# Altium project BMS_MAINBOARD_6.PrjPCB
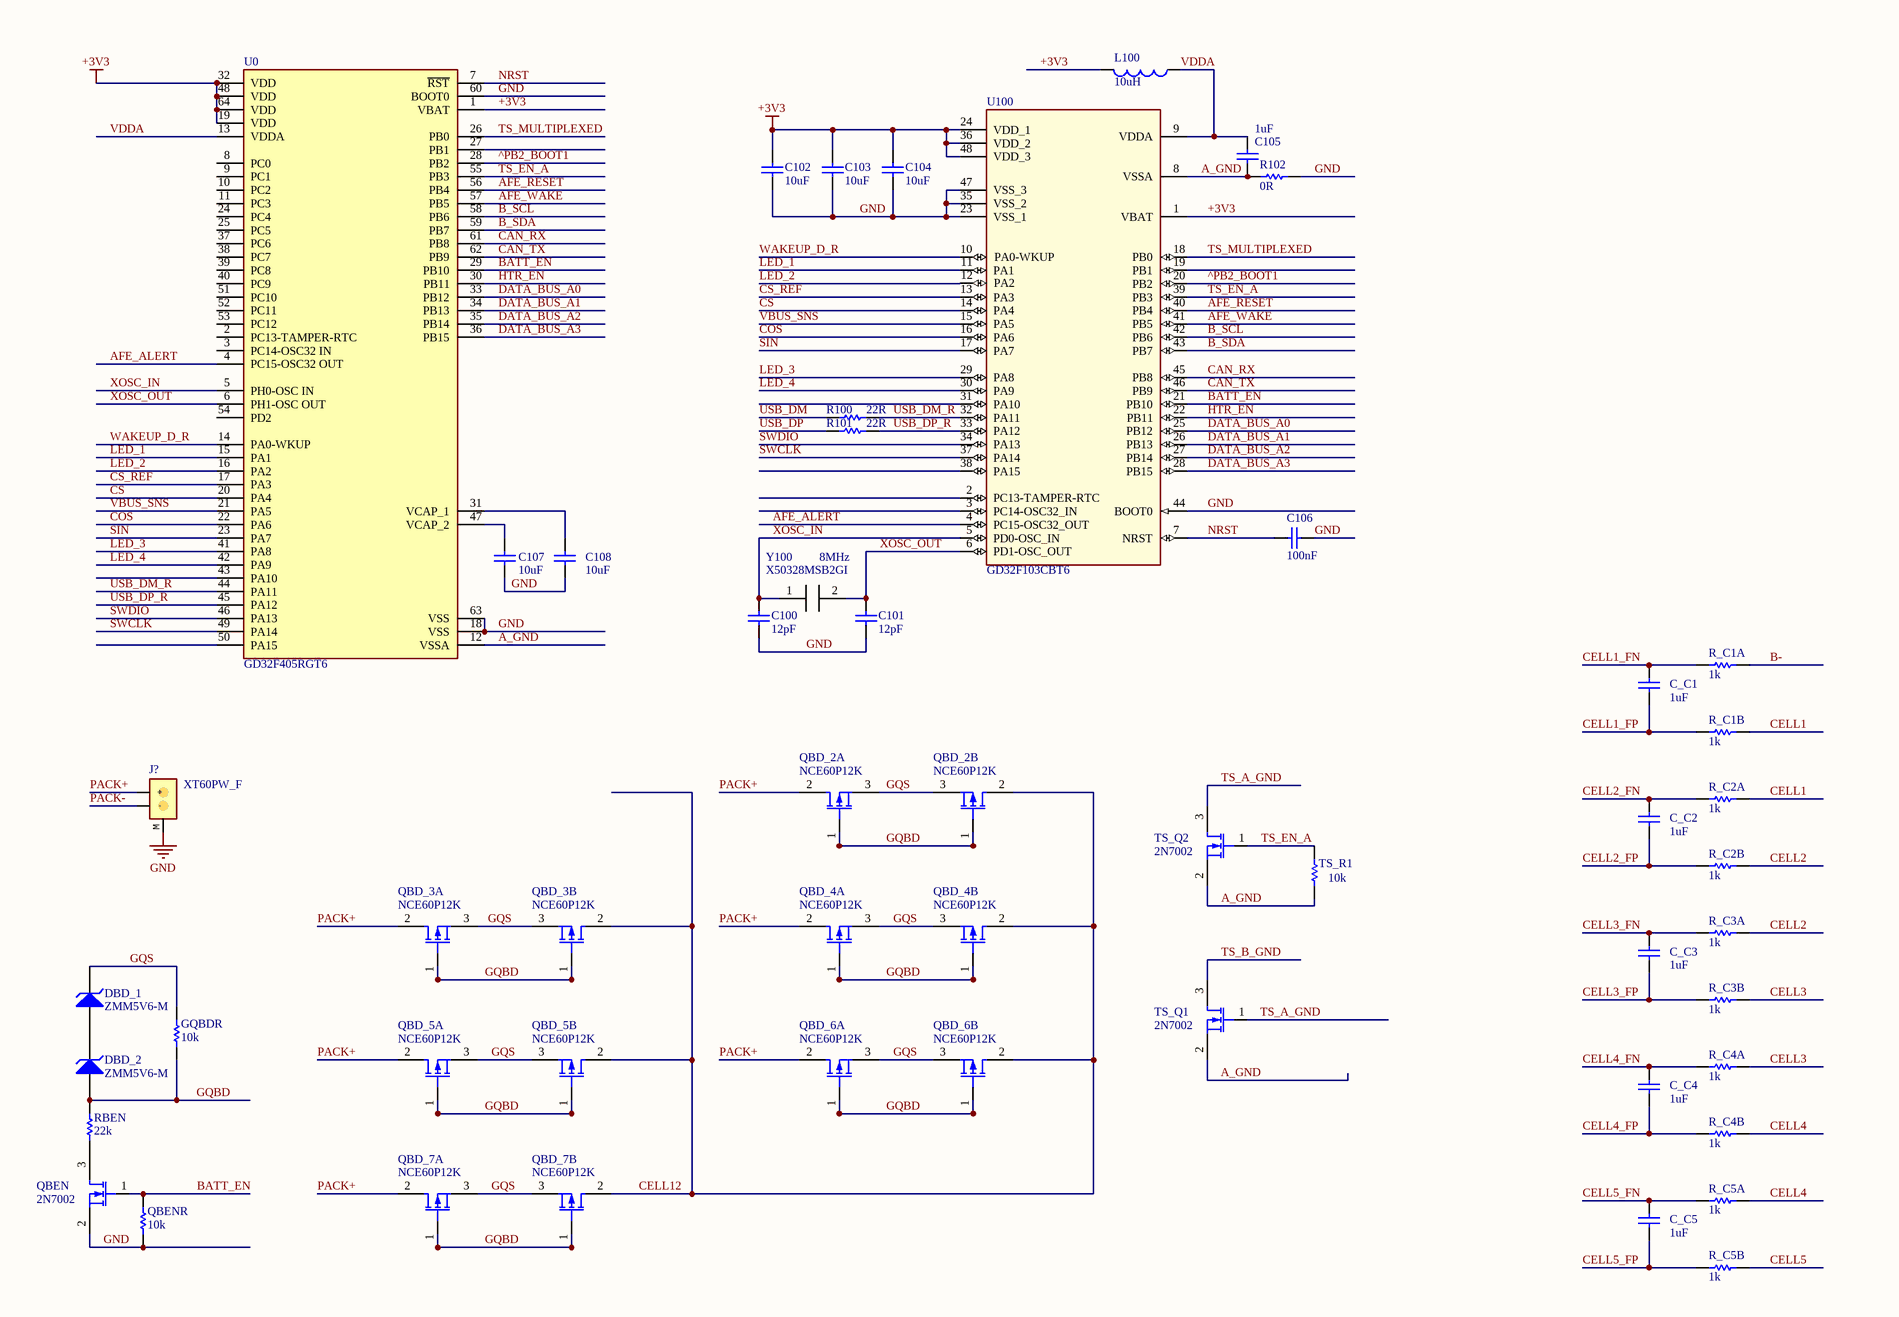
[diagram p0: BMS_MAINBOARD.SchDoc, top left]
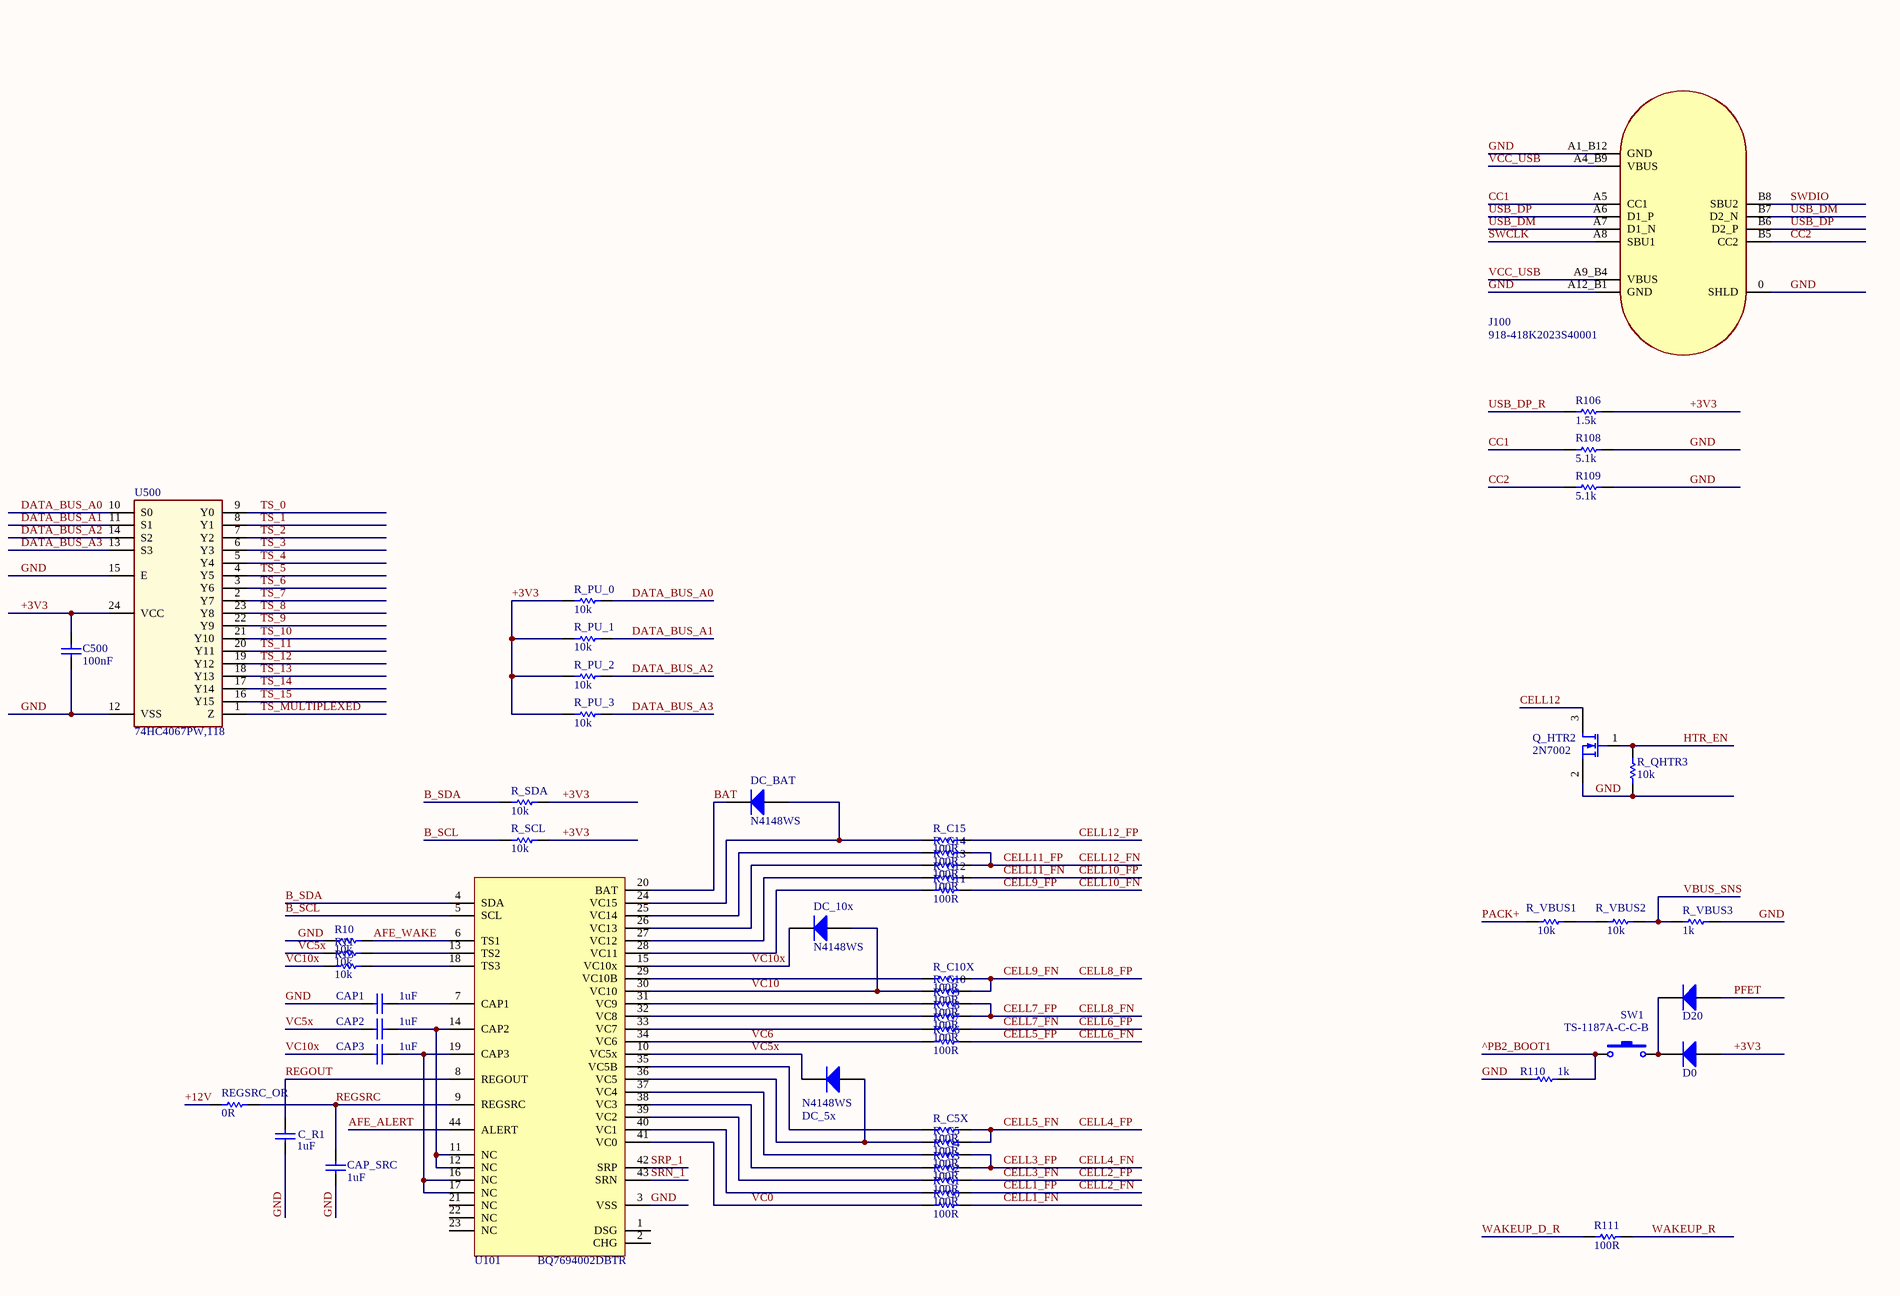
[diagram p1: BMS_MAINBOARD.SchDoc, top right]
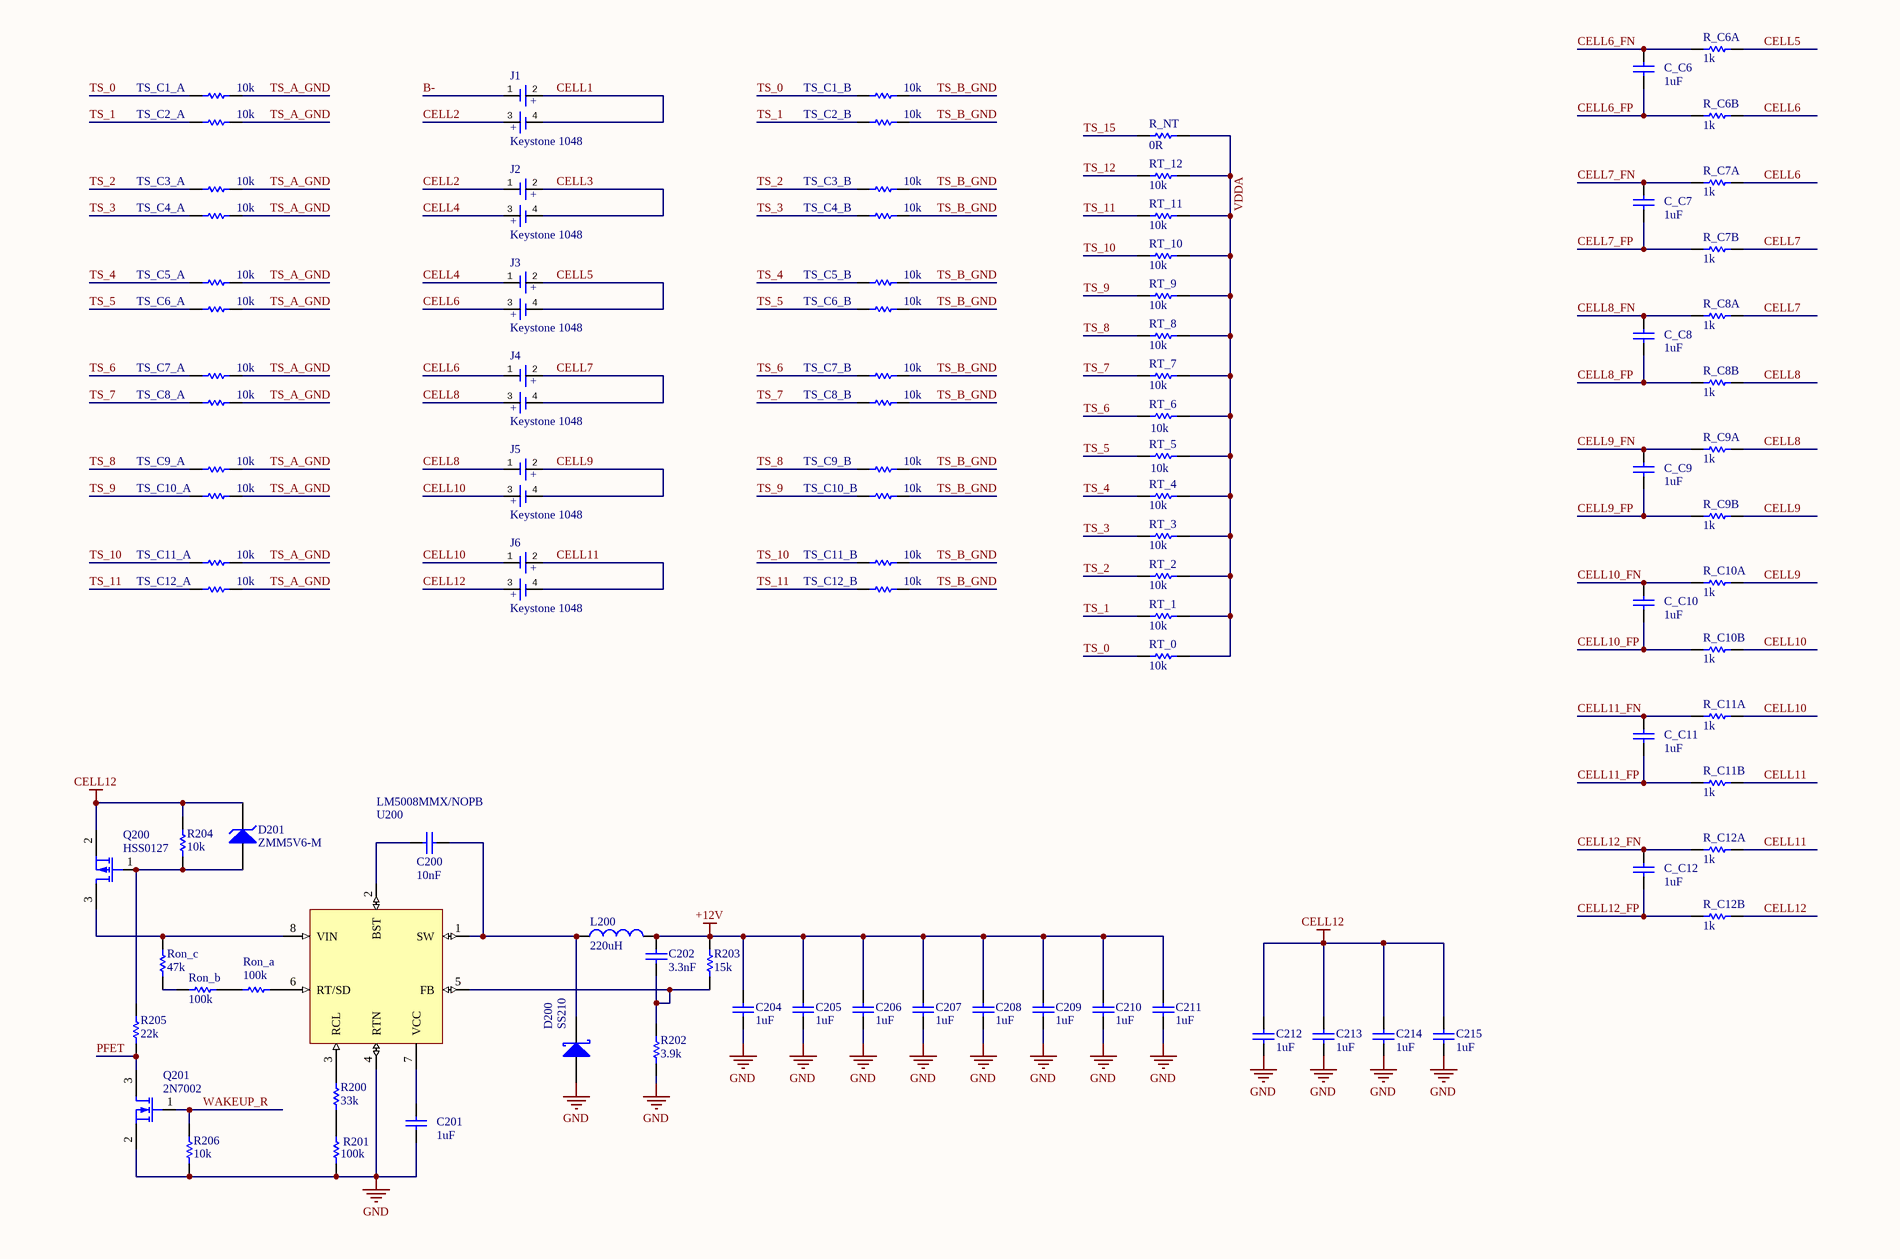
[diagram p2: BMS_MAINBOARD.SchDoc, bottom left]
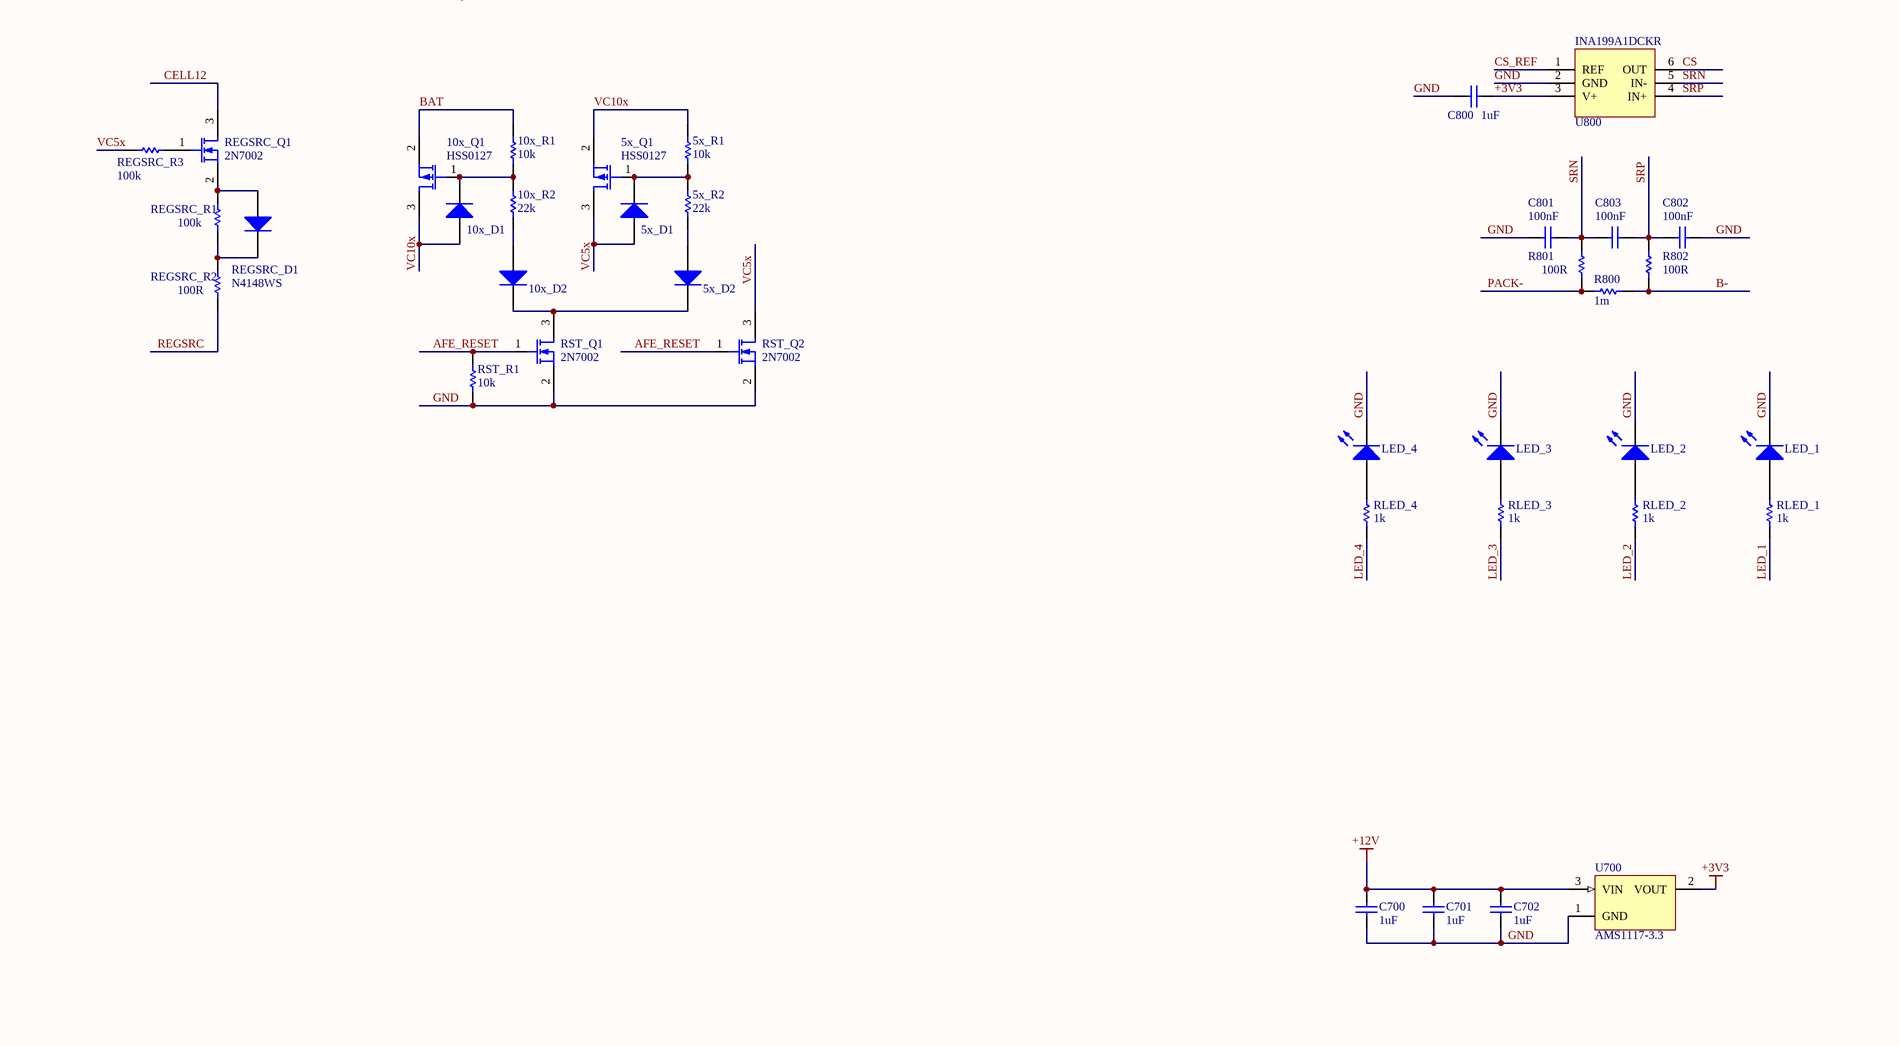
[diagram p3: BMS_MAINBOARD.SchDoc, bottom right]
1 sheet, 240 parts. Net scope: global (net labels, ports and power ports of the same name join across sheets).
Board file: BMS_MAINBOARD_6.PcbDoc

## Sheet BMS_MAINBOARD.SchDoc
size D

### Parts
5x_D1  1N4148WS  [SOD-323]  (value not drawn)
5x_D2  1N4148WS  [SOD-323]  (value not drawn)
5x_Q1  HSS0127  [TO-236AB]
5x_R1  value 10k  [R_0402]  (hidden comment: 0402WGF1002TCE)
5x_R2  value 22k  [R_0402]  (hidden comment: 0402WGF2202TCE)
10x_D1  1N4148WS  [SOD-323]  (value not drawn)
10x_D2  1N4148WS  [SOD-323]  (value not drawn)
10x_Q1  HSS0127  [TO-236AB]
10x_R1  value 10k  [R_0402]  (hidden comment: 0402WGF1002TCE)
10x_R2  value 22k  [R_0402]  (hidden comment: 0402WGF2202TCE)
C100  value 12pF  [C_0402]  (hidden comment: 0402CG120J500NT)
C101  value 12pF  [C_0402]  (hidden comment: 0402CG120J500NT)
C102  value 10uF  [C_0402]  (hidden comment: CL05A106MQ5NUNC)
C103  value 10uF  [C_0402]  (hidden comment: CL05A106MQ5NUNC)
C104  value 10uF  [C_0402]  (hidden comment: CL05A106MQ5NUNC)
C105  value 1uF  [C_0402]  (hidden comment: CL05A105KA5NQNC)
C106  value 100nF  [C_0402]  (hidden comment: CL05B104KO5NNNC)
C107  value 10uF  [C_0402]  (hidden comment: CL05A106MQ5NUNC)
C108  value 10uF  [C_0402]  (hidden comment: CL05A106MQ5NUNC)
C200  value 10nF  [C_0402]  (hidden comment: CL05B103KB5NNNC)
C201  value 1uF  [C_0402]  (hidden comment: CL05A105KA5NQNC)
C202  value 3.3nF  [C_0402]  (hidden comment: CL05B332KB5NNNC)
C204  value 1uF  [C_0402]  (hidden comment: CL05A105KA5NQNC)
C205  value 1uF  [C_0402]  (hidden comment: CL05A105KA5NQNC)
C206  value 1uF  [C_0402]  (hidden comment: CL05A105KA5NQNC)
C207  value 1uF  [C_0402]  (hidden comment: CL05A105KA5NQNC)
C208  value 1uF  [C_0402]  (hidden comment: CL05A105KA5NQNC)
C209  value 1uF  [C_0402]  (hidden comment: CL05A105KA5NQNC)
C210  value 1uF  [C_0402]  (hidden comment: CL05A105KA5NQNC)
C211  value 1uF  [C_0402]  (hidden comment: CL05A105KA5NQNC)
C212  value 1uF  [C_1206]  (hidden comment: 1206B105K101NT)
C213  value 1uF  [C_1206]  (hidden comment: 1206B105K101NT)
C214  value 1uF  [C_1206]  (hidden comment: 1206B105K101NT)
C215  value 1uF  [C_1206]  (hidden comment: 1206B105K101NT)
C500  value 100nF  [C_0402]  (hidden comment: CL05B104KO5NNNC)
C700  value 1uF  [C_0402]  (hidden comment: CL05A105KA5NQNC)
C701  value 1uF  [C_0402]  (hidden comment: CL05A105KA5NQNC)
C702  value 1uF  [C_0402]  (hidden comment: CL05A105KA5NQNC)
C800  value 1uF  [C_0402]  (hidden comment: CL05A105KA5NQNC)
C801  value 100nF  [C_0402]  (hidden comment: CL05B104KO5NNNC)
C802  value 100nF  [C_0402]  (hidden comment: CL05B104KO5NNNC)
C803  value 100nF  [C_0402]  (hidden comment: CL05B104KO5NNNC)
C_C1  value 1uF  [C_0402]  (hidden comment: CL05A105KA5NQNC)
C_C2  value 1uF  [C_0402]  (hidden comment: CL05A105KA5NQNC)
C_C3  value 1uF  [C_0402]  (hidden comment: CL05A105KA5NQNC)
C_C4  value 1uF  [C_0402]  (hidden comment: CL05A105KA5NQNC)
C_C5  value 1uF  [C_0402]  (hidden comment: CL05A105KA5NQNC)
C_C6  value 1uF  [C_0402]  (hidden comment: CL05A105KA5NQNC)
C_C7  value 1uF  [C_0402]  (hidden comment: CL05A105KA5NQNC)
C_C8  value 1uF  [C_0402]  (hidden comment: CL05A105KA5NQNC)
C_C9  value 1uF  [C_0402]  (hidden comment: CL05A105KA5NQNC)
C_C10  value 1uF  [C_0402]  (hidden comment: CL05A105KA5NQNC)
C_C11  value 1uF  [C_0402]  (hidden comment: CL05A105KA5NQNC)
C_C12  value 1uF  [C_0402]  (hidden comment: CL05A105KA5NQNC)
C_R1  value 1uF  [C_0402]  (hidden comment: CL05A105KA5NQNC)
CAP1  value 1uF  [C_0402]  (hidden comment: CL05A105KA5NQNC)
CAP2  value 1uF  [C_0402]  (hidden comment: CL05A105KA5NQNC)
CAP3  value 1uF  [C_0402]  (hidden comment: CL05A105KA5NQNC)
CAP_SRC  value 1uF  [C_0402]  (hidden comment: CL05A105KA5NQNC)
D0  1N4148WS  [SOD-323]  (value not drawn)
D20  1N4148WS  [SOD-323]  (value not drawn)
D200  SS210  [DO-214AC]
D201  ZMM5V6-M  [DO-213AA]
DBD_1  ZMM5V6-M  [DO-213AA]
DBD_2  ZMM5V6-M  [DO-213AA]
DC_5x  N4148WS  [SOD-323]
DC_10x  N4148WS  [SOD-323]
DC_BAT  N4148WS  [SOD-323]
GQBDR  value 10k  [R_0402]  (hidden comment: 0402WGF1002TCE)
J1  Keystone 1048  [Keystone 1048]
J2  Keystone 1048  [Keystone 1048]
J3  Keystone 1048  [Keystone 1048]
J4  Keystone 1048  [Keystone 1048]
J5  Keystone 1048  [Keystone 1048]
J6  Keystone 1048  [Keystone 1048]
J100  918-418K2023S40001  [DX07S016JA1R1500]
J?  XT60PW_F  [XT60PW_F]
L100  value 10uH  [L_0603]  (hidden comment: SDFL1608S100KTF)
L200  value 220uH  [SRR1260]  (hidden comment: SWRB1207S-221MT)
LED_1  19-21UYC/S530-A4/TR8  [D_0603]  (value not drawn)
LED_2  19-21UYC/S530-A4/TR8  [D_0603]  (value not drawn)
LED_3  19-21UYC/S530-A4/TR8  [D_0603]  (value not drawn)
LED_4  19-21UYC/S530-A4/TR8  [D_0603]  (value not drawn)
Q200  HSS0127  [TO-236AB]
Q201  2N7002  [TO-236AB]
Q_HTR2  2N7002  [TO-236AB]
QBD_2A  NCE60P12K  [TO-252AA]
QBD_2B  NCE60P12K  [TO-252AA]
QBD_3A  NCE60P12K  [TO-252AA]
QBD_3B  NCE60P12K  [TO-252AA]
QBD_4A  NCE60P12K  [TO-252AA]
QBD_4B  NCE60P12K  [TO-252AA]
QBD_5A  NCE60P12K  [TO-252AA]
QBD_5B  NCE60P12K  [TO-252AA]
QBD_6A  NCE60P12K  [TO-252AA]
QBD_6B  NCE60P12K  [TO-252AA]
QBD_7A  NCE60P12K  [TO-252AA]
QBD_7B  NCE60P12K  [TO-252AA]
QBEN  2N7002  [TO-236AB]
QBENR  value 10k  [R_0402]  (hidden comment: 0402WGF1002TCE)
R10  value 10k  [R_0402]  (hidden comment: 0402WGF1002TCE)
R11  value 10k  [R_0402]  (hidden comment: 0402WGF1002TCE)
R13  value 10k  [R_0402]  (hidden comment: 0402WGF1002TCE)
R100  value 22R  [R_0402]  (hidden comment: 0402WGF220JTCE)
R101  value 22R  [R_0402]  (hidden comment: 0402WGF220JTCE)
R102  value 0R  [R_0402]  (hidden comment: 0402WGF0000TCE)
R106  value 1.5k  [R_0402]  (hidden comment: 0402WGF1501TCE)
R108  value 5.1k  [R_0402]  (hidden comment: 0402WGF5101TCE)
R109  value 5.1k  [R_0402]  (hidden comment: 0402WGF5101TCE)
R110  value 1k  [R_0402]  (hidden comment: 0402WGF1001TCE)
R111  value 100R  [R_0402]  (hidden comment: 0402WGF1000TCE)
R200  value 33k  [R_0402]  (hidden comment: 0402WGF3302TCE)
R201  value 100k  [R_0402]  (hidden comment: 0402WGF1003TCE)
R202  value 3.9k  [R_0402]  (hidden comment: 0402WGF3901TCE)
R203  value 15k  [R_0402]  (hidden comment: 0402WGF1502TCE)
R204  value 10k  [R_0402]  (hidden comment: 0402WGF1002TCE)
R205  value 22k  [R_0402]  (hidden comment: 0402WGF2202TCE)
R206  value 10k  [R_0402]  (hidden comment: 0402WGF1002TCE)
R800  1m  [R_2512]
R801  value 100R  [R_0402]  (hidden comment: 0402WGF1000TCE)
R802  value 100R  [R_0402]  (hidden comment: 0402WGF1000TCE)
R_C0  value 100R  [R_0402]  (hidden comment: 0402WGF1000TCE)
R_C1  value 100R  [R_0402]  (hidden comment: 0402WGF1000TCE)
R_C1A  value 1k  [R_0402]  (hidden comment: 0402WGF1001TCE)
R_C1B  value 1k  [R_0402]  (hidden comment: 0402WGF1001TCE)
R_C2  value 100R  [R_0402]  (hidden comment: 0402WGF1000TCE)
R_C2A  value 1k  [R_0402]  (hidden comment: 0402WGF1001TCE)
R_C2B  value 1k  [R_0402]  (hidden comment: 0402WGF1001TCE)
R_C3  value 100R  [R_0402]  (hidden comment: 0402WGF1000TCE)
R_C3A  value 1k  [R_0402]  (hidden comment: 0402WGF1001TCE)
R_C3B  value 1k  [R_0402]  (hidden comment: 0402WGF1001TCE)
R_C4  value 100R  [R_0402]  (hidden comment: 0402WGF1000TCE)
R_C4A  value 1k  [R_0402]  (hidden comment: 0402WGF1001TCE)
R_C4B  value 1k  [R_0402]  (hidden comment: 0402WGF1001TCE)
R_C5  value 100R  [R_0402]  (hidden comment: 0402WGF1000TCE)
R_C5A  value 1k  [R_0402]  (hidden comment: 0402WGF1001TCE)
R_C5B  value 1k  [R_0402]  (hidden comment: 0402WGF1001TCE)
R_C5X  value 100R  [R_0402]  (hidden comment: 0402WGF1000TCE)
R_C6  value 100R  [R_0402]  (hidden comment: 0402WGF1000TCE)
R_C6A  value 1k  [R_0402]  (hidden comment: 0402WGF1001TCE)
R_C6B  value 1k  [R_0402]  (hidden comment: 0402WGF1001TCE)
R_C7  value 100R  [R_0402]  (hidden comment: 0402WGF1000TCE)
R_C7A  value 1k  [R_0402]  (hidden comment: 0402WGF1001TCE)
R_C7B  value 1k  [R_0402]  (hidden comment: 0402WGF1001TCE)
R_C8  value 100R  [R_0402]  (hidden comment: 0402WGF1000TCE)
R_C8A  value 1k  [R_0402]  (hidden comment: 0402WGF1001TCE)
R_C8B  value 1k  [R_0402]  (hidden comment: 0402WGF1001TCE)
R_C9  value 100R  [R_0402]  (hidden comment: 0402WGF1000TCE)
R_C9A  value 1k  [R_0402]  (hidden comment: 0402WGF1001TCE)
R_C9B  value 1k  [R_0402]  (hidden comment: 0402WGF1001TCE)
R_C10  value 100R  [R_0402]  (hidden comment: 0402WGF1000TCE)
R_C10A  value 1k  [R_0402]  (hidden comment: 0402WGF1001TCE)
R_C10B  value 1k  [R_0402]  (hidden comment: 0402WGF1001TCE)
R_C10X  value 100R  [R_0402]  (hidden comment: 0402WGF1000TCE)
R_C11  value 100R  [R_0402]  (hidden comment: 0402WGF1000TCE)
R_C11A  value 1k  [R_0402]  (hidden comment: 0402WGF1001TCE)
R_C11B  value 1k  [R_0402]  (hidden comment: 0402WGF1001TCE)
R_C12  value 100R  [R_0402]  (hidden comment: 0402WGF1000TCE)
R_C12A  value 1k  [R_0402]  (hidden comment: 0402WGF1001TCE)
R_C12B  value 1k  [R_0402]  (hidden comment: 0402WGF1001TCE)
R_C13  value 100R  [R_0402]  (hidden comment: 0402WGF1000TCE)
R_C14  value 100R  [R_0402]  (hidden comment: 0402WGF1000TCE)
R_C15  value 100R  [R_0402]  (hidden comment: 0402WGF1000TCE)
R_NT  value 0R  [R_0402]  (hidden comment: 0402WGF0000TCE)
R_PU_0  value 10k  [R_0402]  (hidden comment: 0402WGF1002TCE)
R_PU_1  value 10k  [R_0402]  (hidden comment: 0402WGF1002TCE)
R_PU_2  value 10k  [R_0402]  (hidden comment: 0402WGF1002TCE)
R_PU_3  value 10k  [R_0402]  (hidden comment: 0402WGF1002TCE)
R_QHTR3  value 10k  [R_0402]  (hidden comment: 0402WGF1002TCE)
R_SCL  value 10k  [R_0402]  (hidden comment: 0402WGF1002TCE)
R_SDA  value 10k  [R_0402]  (hidden comment: 0402WGF1002TCE)
R_VBUS1  value 10k  [R_0402]  (hidden comment: 0402WGF1002TCE)
R_VBUS2  value 10k  [R_0402]  (hidden comment: 0402WGF1002TCE)
R_VBUS3  value 1k  [R_0402]  (hidden comment: 0402WGF1001TCE)
RBEN  value 22k  [R_0402]  (hidden comment: 0402WGF2202TCE)
REGSRC_D1  N4148WS  [SOD-323]
REGSRC_OR  value 0R  [R_0402]  (hidden comment: 0402WGF0000TCE)
REGSRC_Q1  2N7002  [TO-236AB]
REGSRC_R1  value 100k  [R_0402]  (hidden comment: 0402WGF1003TCE)
REGSRC_R2  value 100R  [R_0402]  (hidden comment: 0402WGF1000TCE)
REGSRC_R3  value 100k  [R_0402]  (hidden comment: 0402WGF1003TCE)
RLED_1  value 1k  [R_0402]  (hidden comment: 0402WGF1001TCE)
RLED_2  value 1k  [R_0402]  (hidden comment: 0402WGF1001TCE)
RLED_3  value 1k  [R_0402]  (hidden comment: 0402WGF1001TCE)
RLED_4  value 1k  [R_0402]  (hidden comment: 0402WGF1001TCE)
Ron_a  value 100k  [R_0402]  (hidden comment: 0402WGF1003TCE)
Ron_b  value 100k  [R_0402]  (hidden comment: 0402WGF1003TCE)
Ron_c  value 47k  [R_0402]  (hidden comment: 0402WGF4702TCE)
RST_Q1  2N7002  [TO-236AB]
RST_Q2  2N7002  [TO-236AB]
RST_R1  value 10k  [R_0402]  (hidden comment: 0402WGF1002TCE)
RT_0  value 10k  [R_0402]  (hidden comment: 0402WGF1002TCE)
RT_1  value 10k  [R_0402]  (hidden comment: 0402WGF1002TCE)
RT_2  value 10k  [R_0402]  (hidden comment: 0402WGF1002TCE)
RT_3  value 10k  [R_0402]  (hidden comment: 0402WGF1002TCE)
RT_4  value 10k  [R_0402]  (hidden comment: 0402WGF1002TCE)
RT_5  value 10k  [R_0402]  (hidden comment: 0402WGF1002TCE)
RT_6  value 10k  [R_0402]  (hidden comment: 0402WGF1002TCE)
RT_7  value 10k  [R_0402]  (hidden comment: 0402WGF1002TCE)
RT_8  value 10k  [R_0402]  (hidden comment: 0402WGF1002TCE)
RT_9  value 10k  [R_0402]  (hidden comment: 0402WGF1002TCE)
RT_10  value 10k  [R_0402]  (hidden comment: 0402WGF1002TCE)
RT_11  value 10k  [R_0402]  (hidden comment: 0402WGF1002TCE)
RT_12  value 10k  [R_0402]  (hidden comment: 0402WGF1002TCE)
SW1  TS-1187A-C-C-B  [TS-1187A-C-C-B]
TS_C1_A  value 10k  [R_0402]  (hidden comment: NCP15XH103F03RC)
TS_C1_B  value 10k  [R_0402]  (hidden comment: NCP15XH103F03RC)
TS_C2_A  value 10k  [R_0402]  (hidden comment: NCP15XH103F03RC)
TS_C2_B  value 10k  [R_0402]  (hidden comment: NCP15XH103F03RC)
TS_C3_A  value 10k  [R_0402]  (hidden comment: NCP15XH103F03RC)
TS_C3_B  value 10k  [R_0402]  (hidden comment: NCP15XH103F03RC)
TS_C4_A  value 10k  [R_0402]  (hidden comment: NCP15XH103F03RC)
TS_C4_B  value 10k  [R_0402]  (hidden comment: NCP15XH103F03RC)
TS_C5_A  value 10k  [R_0402]  (hidden comment: NCP15XH103F03RC)
TS_C5_B  value 10k  [R_0402]  (hidden comment: NCP15XH103F03RC)
TS_C6_A  value 10k  [R_0402]  (hidden comment: NCP15XH103F03RC)
TS_C6_B  value 10k  [R_0402]  (hidden comment: NCP15XH103F03RC)
TS_C7_A  value 10k  [R_0402]  (hidden comment: NCP15XH103F03RC)
TS_C7_B  value 10k  [R_0402]  (hidden comment: NCP15XH103F03RC)
TS_C8_A  value 10k  [R_0402]  (hidden comment: NCP15XH103F03RC)
TS_C8_B  value 10k  [R_0402]  (hidden comment: NCP15XH103F03RC)
TS_C9_A  value 10k  [R_0402]  (hidden comment: NCP15XH103F03RC)
TS_C9_B  value 10k  [R_0402]  (hidden comment: NCP15XH103F03RC)
TS_C10_A  value 10k  [R_0402]  (hidden comment: NCP15XH103F03RC)
TS_C10_B  value 10k  [R_0402]  (hidden comment: NCP15XH103F03RC)
TS_C11_A  value 10k  [R_0402]  (hidden comment: NCP15XH103F03RC)
TS_C11_B  value 10k  [R_0402]  (hidden comment: NCP15XH103F03RC)
TS_C12_A  value 10k  [R_0402]  (hidden comment: NCP15XH103F03RC)
TS_C12_B  value 10k  [R_0402]  (hidden comment: NCP15XH103F03RC)
TS_Q1  2N7002  [TO-236AB]
TS_Q2  2N7002  [TO-236AB]
TS_R1  value 10k  [R_0402]  (hidden comment: 0402WGF1002TCE)
U0  GD32F405RGT6  [QFP-64-P0.5MM]
U100  GD32F103CBT6  [QFP-48-P0.5MM]
U101  BQ7694002DBTR  [TSSOP-44-P0.5MM-W4MM]
U200  LM5008MMX/NOPB  [SOP65P490X110-8N]
U500  74HC4067PW,118  [TSSOP-24-P0.65MM-W4.4MM]
U700  AMS1117-3.3  [TO-261AA]
U800  INA199A1DCKR  [SOT-353-6]
Y100  X50328MSB2GI  value 8MHz  [YSX530GA]

### Nets
+3V3: C102.2 C103.2 C104.2 C500.2 C800.1 D0.2(A) L100.2 R106.2 R_PU_0.1 R_PU_1.1 R_PU_2.1 R_PU_3.1 R_SCL.1 R_SDA.1 U0.1(VBAT) U0.19(VDD) U0.32(VDD) U0.48(VDD) U0.64(VDD) U100.1(VBAT) U100.24(VDD_1) U100.36(VDD_2) U100.48(VDD_3) U500.24(VCC) U700.2(VOUT) U800.3(V+)
+12V: C202.2 C204.1 C205.1 C206.1 C207.1 C208.1 C209.1 C210.1 C211.1 C700.2 C701.2 C702.2 L200.2 R203.1 REGSRC_OR.2 U700.3(VIN)
CELL12: C212.2 C213.2 C214.2 C215.2 D201.1(K) J6.3 Q200.2(S) Q_HTR2.3(D) QBD_2B.2(D) QBD_3B.2(D) QBD_4B.2(D) QBD_5B.2(D) QBD_6B.2(D) QBD_7B.2(D) R204.1 R_C12B.2 REGSRC_Q1.3(D)
GND: C100.1 C101.1 C102.1 C103.1 C104.1 C106.1 C107.1 C108.1 C201.2 C204.2 C205.2 C206.2 C207.2 C208.2 C209.2 C210.2 C211.2 C212.1 C213.1 C214.1 C215.1 C500.1 C700.1 C701.1 C702.1 C800.2 C801.1 C802.2 C_R1.2 CAP1.2 CAP_SRC.2 D200.2(A) J100.0(SHLD) J100.A1_B12(GND) J100.A12_B1(GND) J?.M LED_1.1(K) LED_2.1(K) LED_3.1(K) LED_4.1(K) Q201.2(S) Q_HTR2.2(S) QBEN.2(S) QBENR.2 R10.2 R102.1 R108.2 R109.2 R110.2 R201.1 R202.1 R206.2 R_QHTR3.2 R_VBUS3.1 RST_Q1.2(S) RST_Q2.2(S) RST_R1.2 U0.18(VSS) U0.60(BOOT0) U0.63(VSS) U100.23(VSS_1) U100.35(VSS_2) U100.44(BOOT0) U100.47(VSS_3) U101.3(VSS) U200.4(RTN) U500.12(VSS) U500.15(E) U700.1(GND) U800.2(GND)
^PB2_BOOT1: R110.1 SW1.1 U0.28(PB2) U100.20(PB2)
A_GND: C105.1 R102.2 TS_Q1.2(S) TS_Q2.2(S) TS_R1.2 U0.12(VSSA) U100.8(VSSA)
AFE_ALERT: U0.4(PC15-OSC32_OUT) U100.4(PC15-OSC32_OUT) U101.44(ALERT)
AFE_RESET: RST_Q1.1(G) RST_Q2.1(G) RST_R1.1 U0.56(PB4) U100.40(PB4)
AFE_WAKE: R10.1 U0.57(PB5) U100.41(PB5) U101.6(TS1)
B-: J1.1 R800.1 R802.1 R_C1A.2
B_SCL: R_SCL.2 U0.58(PB6) U100.42(PB6) U101.5(SCL)
B_SDA: R_SDA.2 U0.59(PB7) U100.43(PB7) U101.4(SDA)
BAT: 10x_Q1.2(S) 10x_R1.1 DC_BAT.1(K) U101.20(BAT)
BATT_EN: QBEN.1(G) QBENR.1 U0.29(PB10) U100.21(PB10)
CAN_RX: U0.61(PB8) U100.45(PB8)
CAN_TX: U0.62(PB9) U100.46(PB9)
CC1: J100.A5(CC1) R108.1
CC2: J100.B5(CC2) R109.1
CELL1: J1.2 J1.4 R_C1B.2 R_C2A.2
CELL1_FN: C_C1.2 R_C0.2 R_C1A.1
CELL1_FP: C_C1.1 C_C2.2 R_C1.2 R_C1B.1 R_C2A.1  [also labelled CELL2_FN]
CELL2: J1.3 J2.1 R_C2B.2 R_C3A.2
CELL2_FP: C_C2.1 C_C3.2 R_C2.2 R_C2B.1 R_C3A.1  [also labelled CELL3_FN]
CELL3: J2.2 J2.4 R_C3B.2 R_C4A.2
CELL3_FP: C_C3.1 C_C4.2 R_C3.2 R_C3B.1 R_C4.2 R_C4A.1  [also labelled CELL4_FN]
CELL4: J2.3 J3.1 R_C4B.2 R_C5A.2
CELL4_FP: C_C4.1 C_C5.2 R_C4B.1 R_C5.2 R_C5A.1 R_C5X.2  [also labelled CELL5_FN]
CELL5: J3.2 J3.4 R_C5B.2 R_C6A.2
CELL5_FP: C_C5.1 C_C6.2 R_C5B.1 R_C6.2 R_C6A.1  [also labelled CELL6_FN]
CELL6: J3.3 J4.1 R_C6B.2 R_C7A.2
CELL6_FP: C_C6.1 C_C7.2 R_C6B.1 R_C7.2 R_C7A.1  [also labelled CELL7_FN]
CELL7: J4.2 J4.4 R_C7B.2 R_C8A.2
CELL7_FP: C_C7.1 C_C8.2 R_C7B.1 R_C8.2 R_C8A.1 R_C9.2  [also labelled CELL8_FN]
CELL8: J4.3 J5.1 R_C8B.2 R_C9A.2
CELL8_FP: C_C8.1 C_C9.2 R_C8B.1 R_C9A.1 R_C10.2 R_C10X.2  [also labelled CELL9_FN]
CELL9: J5.2 J5.4 R_C9B.2 R_C10A.2
CELL10: J5.3 J6.1 R_C10B.2 R_C11A.2
CELL10_FN: C_C9.1 C_C10.2 R_C9B.1 R_C10A.1 R_C11.2  [also labelled CELL9_FP]
CELL10_FP: C_C10.1 C_C11.2 R_C10B.1 R_C11A.1 R_C12.2  [also labelled CELL11_FN]
CELL11: J6.2 J6.4 R_C11B.2 R_C12A.2
CELL11_FP: C_C11.1 C_C12.2 R_C11B.1 R_C12A.1 R_C13.2 R_C14.2  [also labelled CELL12_FN]
CELL12_FP: C_C12.1 R_C12B.1 R_C15.2
COS: U0.22(PA6) U100.16(PA6)
CS: U0.20(PA4) U100.14(PA4) U800.6(OUT)
CS_REF: U0.17(PA3) U100.13(PA3) U800.1(REF)
DATA_BUS_A0: R_PU_0.2 U0.33(PB12) U100.25(PB12) U500.10(S0)
DATA_BUS_A1: R_PU_1.2 U0.34(PB13) U100.26(PB13) U500.11(S1)
DATA_BUS_A2: R_PU_2.2 U0.35(PB14) U100.27(PB14) U500.14(S2)
DATA_BUS_A3: R_PU_3.2 U0.36(PB15) U100.28(PB15) U500.13(S3)
GQBD: DBD_2.2(A) GQBDR.2 QBD_2A.1(G) QBD_2B.1(G) QBD_3A.1(G) QBD_3B.1(G) QBD_4A.1(G) QBD_4B.1(G) QBD_5A.1(G) QBD_5B.1(G) QBD_6A.1(G) QBD_6B.1(G) QBD_7A.1(G) QBD_7B.1(G) RBEN.2
GQS: DBD_1.1(K) GQBDR.1 QBD_2A.3(S) QBD_2B.3(S) QBD_3A.3(S) QBD_3B.3(S) QBD_4A.3(S) QBD_4B.3(S) QBD_5A.3(S) QBD_5B.3(S) QBD_6A.3(S) QBD_6B.3(S) QBD_7A.3(S) QBD_7B.3(S)
HTR_EN: Q_HTR2.1(G) R_QHTR3.1 U0.30(PB11) U100.22(PB11)
LED_1: RLED_1.2 U0.15(PA1) U100.11(PA1)
LED_2: RLED_2.2 U0.16(PA2) U100.12(PA2)
LED_3: RLED_3.2 U0.41(PA8) U100.29(PA8)
LED_4: RLED_4.2 U0.42(PA9) U100.30(PA9)
NRST: C106.2 U0.7(~{RST}) U100.7(NRST)
PACK+: J?.PLUS(+) QBD_2A.2(D) QBD_3A.2(D) QBD_4A.2(D) QBD_5A.2(D) QBD_6A.2(D) QBD_7A.2(D) R_VBUS1.2
PACK-: J?.MINUS(-) R800.2 R801.1
PFET: D20.2(A) Q201.3(D) R205.2
REGOUT: C_R1.1 U101.8(REGOUT)
REGSRC: CAP_SRC.1 REGSRC_OR.1 REGSRC_R2.1 U101.9(REGSRC)
SIN: U0.23(PA7) U100.17(PA7)
SRN: C801.2 C803.1 R801.2 U800.5(IN-)
SRN_1: U101.43(SRN)
SRP: C802.1 C803.2 R802.2 U800.4(IN+)
SRP_1: U101.42(SRP)
SWCLK: J100.A8(SBU1) U0.49(PA14) U100.37(PA14)
SWDIO: J100.B8(SBU2) U0.46(PA13) U100.34(PA13)
TS_0: RT_0.1 TS_C1_A.2 TS_C1_B.2 U500.9(Y0)
TS_1: RT_1.1 TS_C2_A.2 TS_C2_B.2 U500.8(Y1)
TS_2: RT_2.1 TS_C3_A.2 TS_C3_B.2 U500.7(Y2)
TS_3: RT_3.1 TS_C4_A.2 TS_C4_B.2 U500.6(Y3)
TS_4: RT_4.1 TS_C5_A.2 TS_C5_B.2 U500.5(Y4)
TS_5: RT_5.1 TS_C6_A.2 TS_C6_B.2 U500.4(Y5)
TS_6: RT_6.1 TS_C7_A.2 TS_C7_B.2 U500.3(Y6)
TS_7: RT_7.1 TS_C8_A.2 TS_C8_B.2 U500.2(Y7)
TS_8: RT_8.1 TS_C9_A.2 TS_C9_B.2 U500.23(Y8)
TS_9: RT_9.1 TS_C10_A.2 TS_C10_B.2 U500.22(Y9)
TS_10: RT_10.1 TS_C11_A.2 TS_C11_B.2 U500.21(Y10)
TS_11: RT_11.1 TS_C12_A.2 TS_C12_B.2 U500.20(Y11)
TS_12: RT_12.1 U500.19(Y12)
TS_13: U500.18(Y13)
TS_14: U500.17(Y14)
TS_15: R_NT.1 U500.16(Y15)
TS_A_GND: TS_C1_A.1 TS_C2_A.1 TS_C3_A.1 TS_C4_A.1 TS_C5_A.1 TS_C6_A.1 TS_C7_A.1 TS_C8_A.1 TS_C9_A.1 TS_C10_A.1 TS_C11_A.1 TS_C12_A.1 TS_Q1.1(G) TS_Q2.3(D)
TS_B_GND: TS_C1_B.1 TS_C2_B.1 TS_C3_B.1 TS_C4_B.1 TS_C5_B.1 TS_C6_B.1 TS_C7_B.1 TS_C8_B.1 TS_C9_B.1 TS_C10_B.1 TS_C11_B.1 TS_C12_B.1 TS_Q1.3(D)
TS_EN_A: TS_Q2.1(G) TS_R1.1 U0.55(PB3) U100.39(PB3)
TS_MULTIPLEXED: U0.26(PB0) U100.18(PB0) U500.1(Z)
USB_DM: J100.A7(D1_N) J100.B7(D2_N) R100.1
USB_DM_R: R100.2 U0.44(PA11) U100.32(PA11)
USB_DP: J100.A6(D1_P) J100.B6(D2_P) R101.1
USB_DP_R: R101.2 R106.1 U0.45(PA12) U100.33(PA12)
VBUS_SNS: R_VBUS2.1 R_VBUS3.2 U0.21(PA5) U100.15(PA5)
VC0: R_C0.1 U101.41(VC0)
VC5x: 5x_D1.2(A) 5x_Q1.3(D) CAP2.2 DC_5x.1(K) R11.2 REGSRC_R3.1 RST_Q2.3(D) U101.10(VC5x)
VC6: R_C6.1 U101.34(VC6)
VC10: DC_10x.2(A) R_C10.1 U101.30(VC10)
VC10x: 5x_Q1.2(S) 5x_R1.1 10x_D1.2(A) 10x_Q1.3(D) CAP3.2 DC_10x.1(K) R13.2 U101.15(VC10x)
VCC_USB: J100.A4_B9(VBUS) J100.A9_B4(VBUS)
VDDA: C105.2 L100.1 R_NT.2 RT_0.2 RT_1.2 RT_2.2 RT_3.2 RT_4.2 RT_5.2 RT_6.2 RT_7.2 RT_8.2 RT_9.2 RT_10.2 RT_11.2 RT_12.2 U0.13(VDDA) U100.9(VDDA)
WAKEUP_D_R: R111.2 U0.14(PA0-WKUP) U100.10(PA0-WKUP)
WAKEUP_R: Q201.1(G) R111.1 R206.1
XOSC_IN: C100.2 U0.5(PH0-OSC_IN) U100.5(PD0-OSC_IN) Y100.1
XOSC_OUT: C101.2 U0.6(PH1-OSC_OUT) U100.6(PD1-OSC_OUT) Y100.2
Net5x_D1_1: 5x_D1.1(K) 5x_Q1.1(G) 5x_R1.2 5x_R2.1
Net5x_D2_1: 5x_D2.1(K) 10x_D2.1(K) RST_Q1.3(D)
Net5x_D2_2: 5x_D2.2(A) 5x_R2.2
Net10x_D1_1: 10x_D1.1(K) 10x_Q1.1(G) 10x_R1.2 10x_R2.1
Net10x_D2_2: 10x_D2.2(A) 10x_R2.2
NetC107_2: C107.2 U0.47(VCAP_2)
NetC108_2: C108.2 U0.31(VCAP_1)
NetC200_1: C200.1 U200.2(BST)
NetC200_2: C200.2 D200.1(K) L200.1 U200.1(SW)
NetC201_1: C201.1 U200.7(VCC)
NetC202_1: C202.1 R202.2 R203.2 U200.5(FB)
NetCAP1_1: CAP1.1 U101.7(CAP1)
NetCAP2_1: CAP2.1 U101.11(NC) U101.12(NC) U101.14(CAP2)
NetCAP3_1: CAP3.1 U101.16(NC) U101.17(NC) U101.19(CAP3)
NetD0_1: D0.1(K) D20.1(K) SW1.2
NetD201_2: D201.2(A) Q200.1(G) R204.2 R205.1
NetDBD_1_2: DBD_1.2(A) DBD_2.1(K)
NetDC_5x_2: DC_5x.2(A) R_C5.1 U101.36(VC5)
NetDC_BAT_2: DC_BAT.2(A) R_C15.1 U101.24(VC15)
NetLED_1_2: LED_1.2(A) RLED_1.1
NetLED_2_2: LED_2.2(A) RLED_2.1
NetLED_3_2: LED_3.2(A) RLED_3.1
NetLED_4_2: LED_4.2(A) RLED_4.1
NetQ200_3: Q200.3(D) Ron_c.1 U200.8(VIN)
NetQBEN_3: QBEN.3(D) RBEN.1
NetR11_1: R11.1 U101.13(TS2)
NetR13_1: R13.1 U101.18(TS3)
NetR200_1: R200.1 R201.2
NetR200_2: R200.2 U200.3(RCL)
NetR_C1_1: R_C1.1 U101.40(VC1)
NetR_C2_1: R_C2.1 U101.39(VC2)
NetR_C3_1: R_C3.1 U101.38(VC3)
NetR_C4_1: R_C4.1 U101.37(VC4)
NetR_C5X_1: R_C5X.1 U101.35(VC5B)
NetR_C7_1: R_C7.1 U101.33(VC7)
NetR_C8_1: R_C8.1 U101.32(VC8)
NetR_C9_1: R_C9.1 U101.31(VC9)
NetR_C10X_1: R_C10X.1 U101.29(VC10B)
NetR_C11_1: R_C11.1 U101.28(VC11)
NetR_C12_1: R_C12.1 U101.27(VC12)
NetR_C13_1: R_C13.1 U101.26(VC13)
NetR_C14_1: R_C14.1 U101.25(VC14)
NetR_VBUS1_1: R_VBUS1.1 R_VBUS2.2
NetREGSRC_D1_1: REGSRC_D1.1(K) REGSRC_R1.1 REGSRC_R2.2
NetREGSRC_D1_2: REGSRC_D1.2(A) REGSRC_Q1.2(S) REGSRC_R1.2
NetREGSRC_Q1_1: REGSRC_Q1.1(G) REGSRC_R3.2
NetRon_a_1: Ron_a.1 Ron_b.2
NetRon_a_2: Ron_a.2 U200.6(RT/SD)
NetRon_b_1: Ron_b.1 Ron_c.2

Not connected (* = marked no-connect by the designer): U0 2(PC13-TAMPER-RTC) 3(PC14-OSC32_IN) 8(PC0) 9(PC1) 10(PC2) 11(PC3) 24(PC4) 25(PC5) 27(PB1) 37(PC6) 38(PC7) 39(PC8) 40(PC9) 43(PA10) 50(PA15) 51(PC10) 52(PC11) 53(PC12) 54(PD2); U100 2(PC13-TAMPER-RTC) 3(PC14-OSC32_IN) 19(PB1) 31(PA10) 38(PA15); U101 1(DSG) 2(CHG) 21(NC) 22(NC) 23(NC)

### Notes on the sheet
- (in symbol Keystone 1048) +

### Library data of the parts
5x_D1 5x_D2 10x_D1 10x_D2 D0 D20 = 1N4148WS: D - DIODE - FAST TRR - 100V - 150mA - 4ns; LCSC Part #: C2128; JLC Availability: Basic; PIV: 100V; If: 150mA; Trr: 4ns
5x_Q1 10x_Q1 Q200 = HSS0127: Q - TRANSISTOR - MOSFET (P) - 100V - 0.9A - 0.65 Ohm; WVDC: 100; JLC Availability: Extended; LCSC Part #: C700960
5x_R1 10x_R1 GQBDR QBENR R10 R11 R13 R204 R206 R_PU_0-R_PU_3 R_QHTR3 R_SCL R_SDA R_VBUS1 R_VBUS2 RST_R1 RT_0-RT_12 TS_R1 = 0402WGF1002TCE: R - RESISTOR - SMD - 10k - 1% - 0402; LCSC Part #: C25744; JLC Availability: Basic
5x_R2 10x_R2 R205 RBEN = 0402WGF2202TCE: R - RESISTOR - SMD - 22k - 1% - 0402; LCSC Part #: C25768; JLC Availability: Basic
C100 C101 = 0402CG120J500NT: C - CAPACITOR - MLCC - 12pF - 50V - 0402; WVDC: 50; LCSC Part #: C1547; JLC Availability: Basic
C102-C104 C107 C108 = CL05A106MQ5NUNC: C - CAPACITOR - MLCC - 10uF - 6.3V - 0402; WVDC: 6.3; LCSC Part #: C15525; JLC Availability: Basic
C105 C201 C204-C211 C700-C702 C800 C_C1-C_C12 C_R1 CAP1-CAP3 CAP_SRC = CL05A105KA5NQNC: C - CAPACITOR - MLCC - 1uF - 25V - 0402; WVDC: 16; LCSC Part #: C52923; JLC Availability: Basic
C106 C500 C801-C803 = CL05B104KO5NNNC: C - CAPACITOR - MLCC - 100nF - 16V - 0402; WVDC: 16; LCSC Part #: C1525; JLC Availability: Basic
C200 = CL05B103KB5NNNC: C - CAPACITOR - MLCC - 10nF - 50V - 0402; WVDC: 50; LCSC Part #: C15195; JLC Availability: Basic
C202 = CL05B332KB5NNNC: C - CAPACITOR - MLCC - 3.3nF - 50V - 0402; WVDC: 50; LCSC Part #: C26404; JLC Availability: Basic
C212-C215 = 1206B105K101NT: C - CAPACITOR - MLCC - 1uF - 100V - 1206 - X7R; WVDC: 100; LCSC Part #: C91151; JLC Availability: Extended
D200 = SS210: D - DIODE - SCHOTTKY - 100V - 2A; Vrrm: 100; If: 2A; LCSC Part #: C14996; JLC Availability: Extended
D201 DBD_1 DBD_2 = ZMM5V6-M: D - DIODE - ZENER - 5.6V - 500mW; LCSC Part #: C8062; JLC Availability: BASIC
DC_5x DC_10x DC_BAT REGSRC_D1 = N4148WS: D - DIODE - FAST TRR - 100V - 150mA - 4ns; LCSC Part #: C2128; JLC Availability: Basic; PIV: 100V; If: 150mA; Trr: 4ns
J1-J6 = Keystone 1048: J - JACK - SMT Battery Holder 18650X2 Cells
J100 = 918-418K2023S40001: J - JACK - USB - Type C - Recepticle - SMT - 90°; JLC Availability: LCSC; LCSC Part #: C167321
J? = XT60PW_F: J - JACK - POWER - XT60 - RIGHT - FEMALE; LCSC Part #: X; JLC Availability: None
L100 = SDFL1608S100KTF: L - INDUCTOR - 10uH - 0603; LCSC Part #: C1035; JLC Availability: Basic
L200 = SWRB1207S-221MT: L - INDUCTOR - 220uH - 1.6A - 12.5mm; Isat: 1.6A; LCSC Part #: C169380; JLC Availability: Extended
LED_1-LED_4 = 19-21UYC/S530-A4/TR8: D - LED - 0603 - Yellow (Sodium); LCSC Part #: C409441; JLC Availability: Extended
Q201 Q_HTR2 QBEN REGSRC_Q1 RST_Q1 RST_Q2 TS_Q1 TS_Q2 = 2N7002: Q - TRANSISTOR - MOSFET (N) - 60V - 200mW; JLC Availability: Basic; LCSC Part #: C8545
QBD_2A QBD_2B QBD_3A QBD_3B QBD_4A QBD_4B QBD_5A QBD_5B QBD_6A QBD_6B QBD_7A QBD_7B = NCE60P12K: Q - TRANSISTOR - MOSFET (P) - 60V - 12A - 0.1R; LCSC Part #: C326372; JLC Availability: Extended
R100 R101 = 0402WGF220JTCE: R - RESISTOR - SMD - 22R - 1% - 0402; LCSC Part #: C25092; JLC Availability: Basic
R102 R_NT REGSRC_OR = 0402WGF0000TCE: R - RESISTOR - SMD - 0R - 1% - 0402; LCSC Part #: C17168; JLC Availability: Basic
R106 = 0402WGF1501TCE: R - RESISTOR - SMD - 1.5k - 1% - 0402; LCSC Part #: C25867; JLC Availability: Basic
R108 R109 = 0402WGF5101TCE: R - RESISTOR - SMD - 5.1k - 1% - 0402; LCSC Part #: C25905; JLC Availability: Basic
R110 R_C1A R_C1B R_C2A R_C2B R_C3A R_C3B R_C4A R_C4B R_C5A R_C5B R_C6A R_C6B R_C7A R_C7B R_C8A R_C8B R_C9A R_C9B R_C10A R_C10B R_C11A R_C11B R_C12A R_C12B R_VBUS3 RLED_1-RLED_4 = 0402WGF1001TCE: R - RESISTOR - SMD - 1k - 1% - 0402; LCSC Part #: C11702; JLC Availability: Basic
R111 R801 R802 R_C0-R_C5 R_C5X R_C6-R_C10 R_C10X R_C11-R_C15 REGSRC_R2 = 0402WGF1000TCE: R - RESISTOR - SMD - 100R - 1% - 0402; LCSC Part #: C25076; JLC Availability: Basic
R200 = 0402WGF3302TCE: R - RESISTOR - SMD - 33k - 1% - 0402; LCSC Part #: C25779; JLC Availability: Basic
R201 REGSRC_R1 REGSRC_R3 Ron_a Ron_b = 0402WGF1003TCE: R - RESISTOR - SMD - 100k - 1% -  0402; LCSC Part #: C25741; JLC Availability: Basic
R202 = 0402WGF3901TCE: R - RESISTOR - SMD - 3.9k - 1% - 0402; LCSC Part #: C51721; JLC Availability: Basic
R203 = 0402WGF1502TCE: R - RESISTOR - SMD - 15k - 1% - 0402; LCSC Part #: C25756; JLC Availability: Basic
R800 = MRF6432(2512)LR001FTS: R - RESISTOR - SMD - 0.001R - 1% - 2512 - 2W; ComponentLink1URL: http://riedon.com/media/pdf/CSR.pdf; ComponentLink1Description: http://riedon.com/media/pdf/CSR.pdf; LCSC Part #: C76233; Power: 2W; JLC Availability: Extended
Ron_c = 0402WGF4702TCE: R - RESISTOR - SMD - 47k - 1% - 0402; LCSC Part #: C25792; JLC Availability: Basic
SW1 = TS-1187A-C-C-B: SW - SWITCH - SPST - NO - Top Actuated Surface Mount; LCSC Part #: C318889; JLC Availability: Extended
TS_C1_A TS_C1_B TS_C2_A TS_C2_B TS_C3_A TS_C3_B TS_C4_A TS_C4_B TS_C5_A TS_C5_B TS_C6_A TS_C6_B TS_C7_A TS_C7_B TS_C8_A TS_C8_B TS_C9_A TS_C9_B TS_C10_A TS_C10_B TS_C11_A TS_C11_B TS_C12_A TS_C12_B = NCP15XH103F03RC: RT - NTC THERMISTOR - 10k - 1% - 0402; Value2: 3380k; LCSC Part #: C77131; JLC Availability: Extended
U0 = GD32F405RGT6: U - IC - MCU 32BIT 1MB FLASH 64LQFP; ComponentLink2Description: Datasheet; ComponentLink1URL: https://upverter.com/upn/revision/179c87d5c3d4f257/; ComponentLink1Description: Upverter; ComponentLink2URL: http://www.st.com/content/ccc/resource/technical/document/datasheet/33/d4/6f/1d/df/0b/4c/6d/CD00161566.pdf/files/CD00161566.pdf/jcr:content/translations/en.CD00161566.pdf; LCSC Part #: C99031; JLC Availability: Extended
U100 = GD32F103CBT6: U - IC - MCU, 128 KB Flash, 20 KB Internal RAM, 37 I/Os, 48-pin LQFP, -40 to 85 degC; FLASH Size (Prog) (kB): 128; I/Os (High Current): 37; Internal RAM Size (kB): 20; Operating Frequency(F) (Processor speed) (MHz): 72; ComponentLink1Description: Manufacturer URL; ComponentLink1URL: http://www.st.com/web/en/home.html; ComponentLink2Description: Datasheet; ComponentLink2URL: http://www.st.com/st-web-ui/static/active/en/resource/technical/document/datasheet/CD00161566.pdf; ComponentLink3Description: Package Specification; ComponentLink3URL: http://www.st.com/st-web-ui/static/active/en/resource/technical/document/datasheet/DM00058181.pdf; LCSC Part #: C77979; JLC Availability: Extended
U101 = BQ7694002DBTR: 9 to 15-series cell li-ion and li-phosphate battery monitor (bq76940 family)
U200 = LM5008MMX/NOPB: U - IC - BUCK CONVERTER, ADJUSTABLE, 95V, 350mA; Package: None; Price: None; Value: *; MP: LM5008MMX/NOPB; Availability: Unavailable
U500 = 74HC4067PW,118: U - IC -16 Port Analog MUX; ComponentLink1Description: Manufacturer URL; ComponentLink1URL: http://www.st.com/web/en/home.html; ComponentLink2Description: Datasheet; ComponentLink2URL: http://www.st.com/st-web-ui/static/active/en/resource/technical/document/datasheet/CD00161566.pdf; ComponentLink3Description: Package Specification; ComponentLink3URL: http://www.st.com/st-web-ui/static/active/en/resource/technical/document/datasheet/DM00058181.pdf; JLC Availability: Extended; LCSC Part #: C179326
U700 = AMS1117-3.3: U - IC - LDO - 3.3V - 800mA; VOut: 3.3; LCSC Part #: C6186; JLC Availability: Basic
U800 = INA199A1DCKR: U - IC - Bidirectional Current-Sensing Amplifiers 50V/V; JLC Availability: Extended; LCSC Part #: C59135
Y100 = X50328MSB2GI: Y - RESONATOR - 8MHZ ±10PPM - SMD-5032; Availability: Basic; LCSC Part #: C115962

## Assembly variants
F1: not fitted REGSRC_OR U0
F4: not fitted REGSRC_OR U100